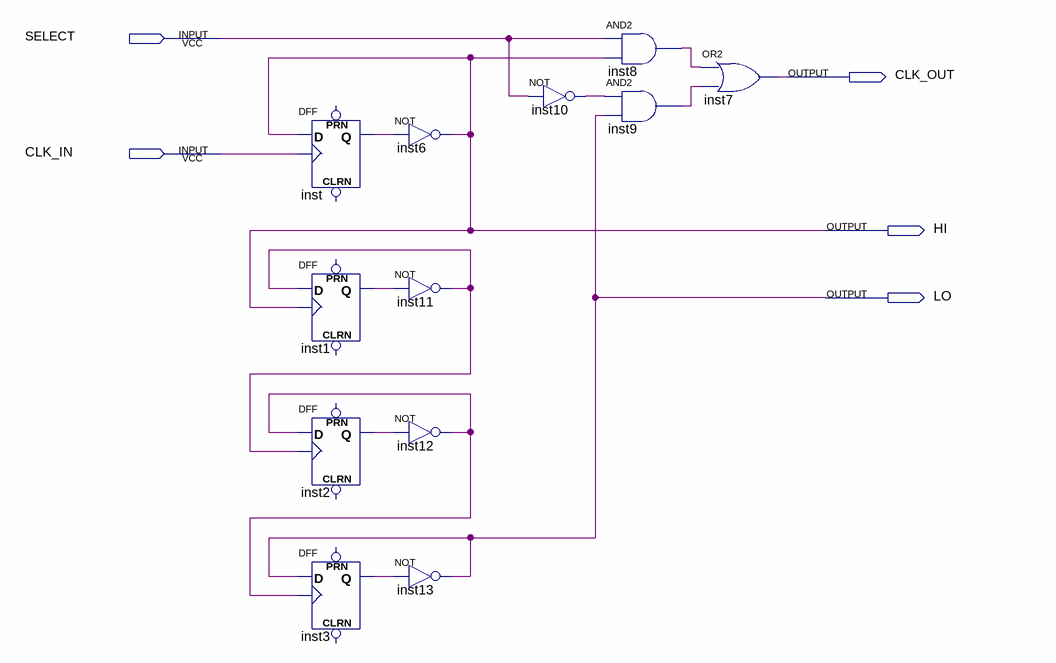
[diagram p0: schematic sheet]
// Quartus schematic Divider.bdf as structural Verilog: 12 symbols, 5 pins
module Divider (
  input  SELECT,
  input  CLK_IN,
  output CLK_OUT,
  output HI,
  output LO
);

  wire inst1_q, inst2_q, inst3_q, inst8_out, inst9_out, inst10_out, inst11_out, inst12_out, inst_q;

  DFF inst (.CLK(CLK_IN), .D(HI), .Q(inst_q));  // open: CLRN, PRN
  DFF inst1 (.CLK(HI), .D(inst11_out), .Q(inst1_q));  // open: CLRN, PRN
  DFF inst2 (.CLK(inst11_out), .D(inst12_out), .Q(inst2_q));  // open: CLRN, PRN
  DFF inst3 (.CLK(inst12_out), .D(LO), .Q(inst3_q));  // open: CLRN, PRN
  not inst6 (HI, inst_q);
  not inst11 (inst11_out, inst1_q);
  not inst12 (inst12_out, inst2_q);
  not inst13 (LO, inst3_q);
  not inst10 (inst10_out, SELECT);
  and inst8 (inst8_out, SELECT, HI);
  and inst9 (inst9_out, inst10_out, LO);
  or inst7 (CLK_OUT, inst8_out, inst9_out);
endmodule
